# EAGLE design Adafruit Feather M0 Adalogger (EAGLE 7.5.0)
COMPANY: ADAFRUIT INDUSTRIES; DRAWN: KTOWN; REV: B
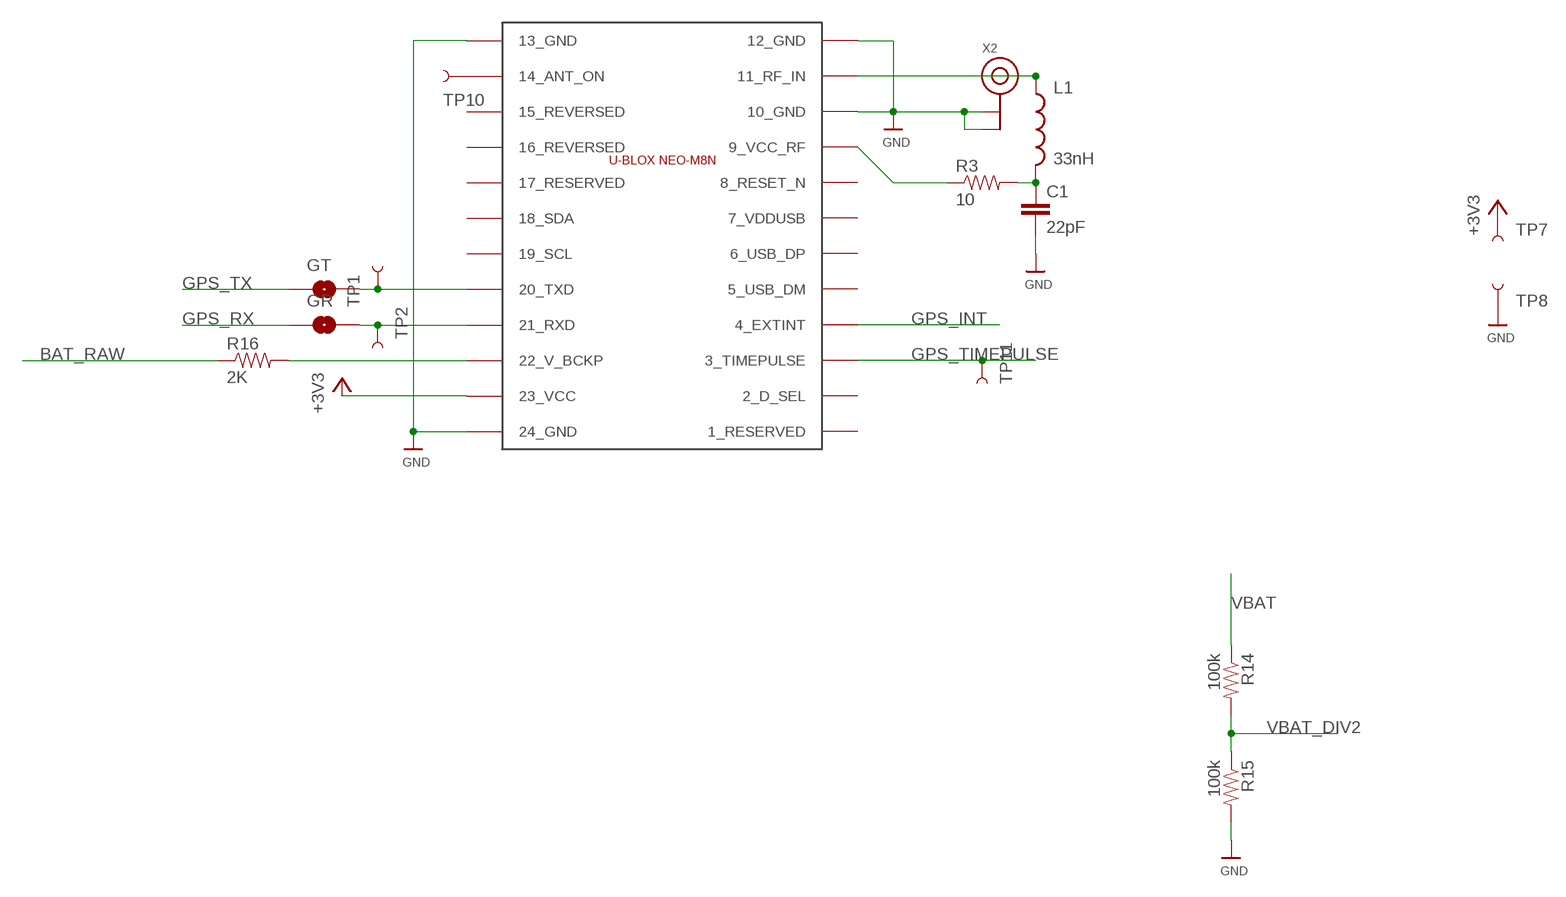
[diagram p0: schematic, sheet 1, part 1 of 2]
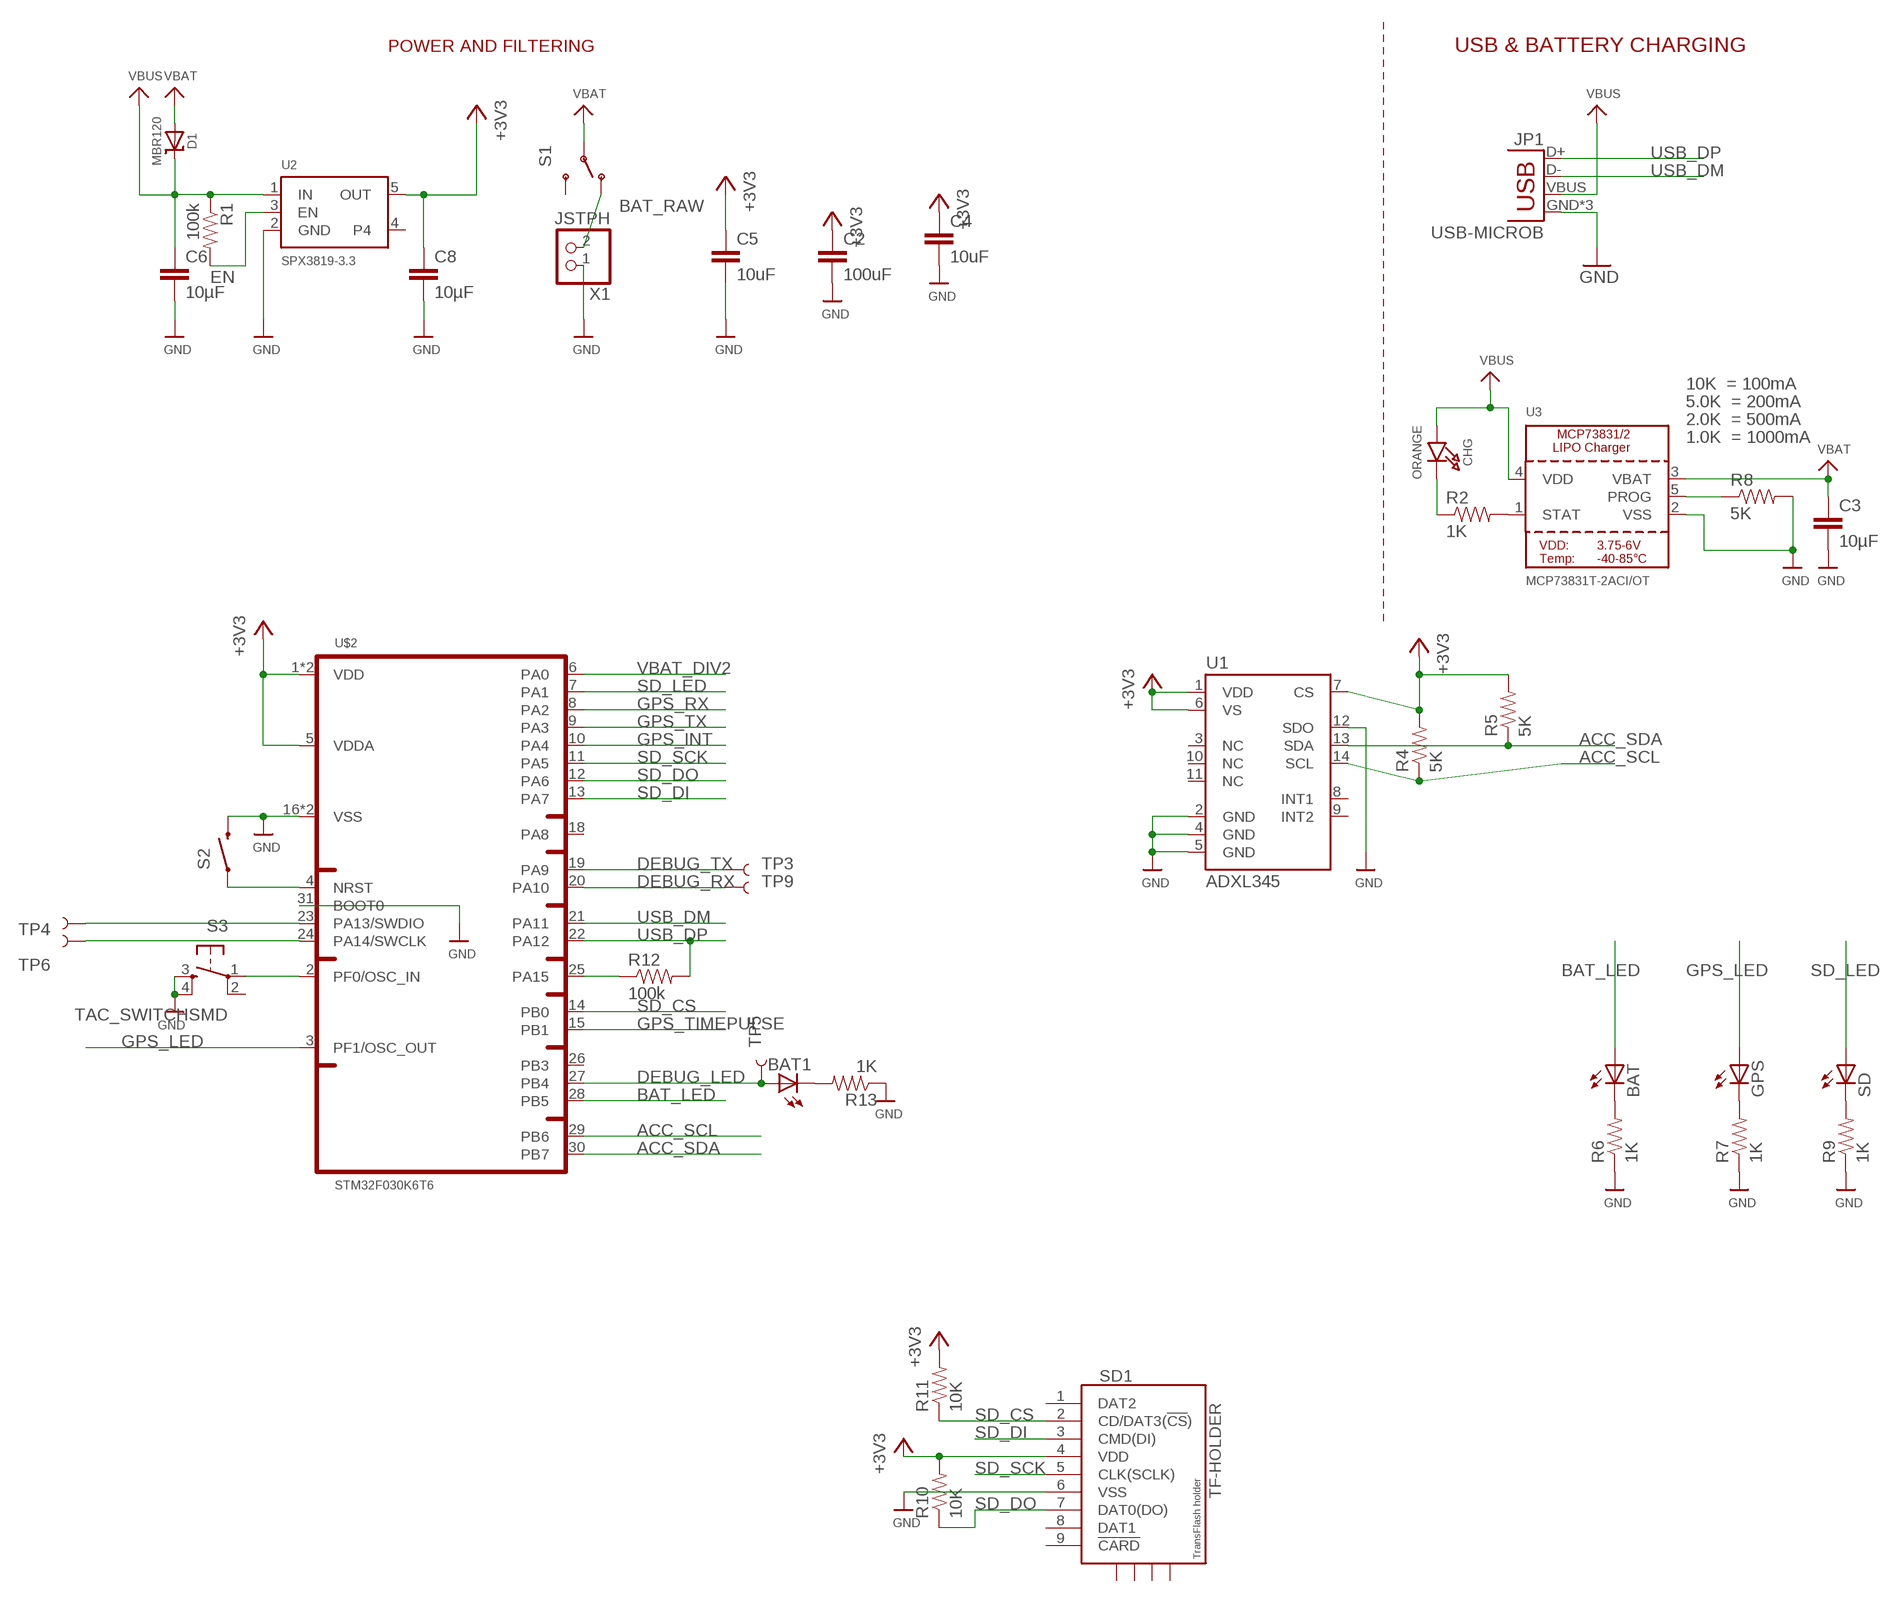
[diagram p1: schematic, sheet 1, part 2 of 2]

## Parts
BAT  LEDCHIPLED_0805  [CHIPLED_0805]
BAT1  LEDCHIPLED_0805  [CHIPLED_0805]
C1  22pF  CAP0805  [0805]
C2  100uF  100UF6.3V20%(1210)  [1210]
C3  10µF  CAP0805  [0805]
C4  10uF  CAP0805  [0805]
C5  10uF  CAP0805  [0805]
C6  10µF  CAP0805  [0805]
C8  10µF  CAP0805  [0805]
CHG  ORANGE  LED0805_NOOUTLINE  [CHIPLED_0805_NOOUTLINE]
D1  MBR120  DIODE-SCHOTTKYSOD-123  [SOD-123]
DEKU1  UBLOX_NEO-M8N  [UBLOX_NEO-M8N]
GPS  LEDCHIPLED_0805  [CHIPLED_0805]
GR  JUMPER-PAD-2-NO  [PAD-JUMPER-2-NO_NO_SILK]
GT  JUMPER-PAD-2-NO  [PAD-JUMPER-2-NO_NO_SILK]
JP1  USB-MICROB  [USB-MICROB]
L1  33nH  INDUCTOR0805  [0805]
R1  100k  RESISTOR0805-RES  [0805]
R2  1K  RESISTOR0805-RES  [0805]
R3  10  RESISTOR0805-RES  [0805]
R4  5K  RESISTOR0805-RES  [0805]
R5  5K  RESISTOR0805-RES  [0805]
R6  1K  RESISTOR0805-RES  [0805]
R7  1K  RESISTOR0805-RES  [0805]
R8  5K  RESISTOR0805-RES  [0805]
R9  1K  RESISTOR0805-RES  [0805]
R10  10K  RESISTOR0805-RES  [0805]
R11  10K  RESISTOR0805-RES  [0805]
R12  100k  RESISTOR0805-RES  [0805]
R13  1K  RESISTOR0805-RES  [0805]
R14  100k  RESISTOR0805-RES  [0805]
R15  100k  RESISTOR0805-RES  [0805]
R16  2K  RESISTOR0805-RES  [0805]
S1  SWITCH-SPDT-SMD-A  [SWITCH-SPST-SMD-A]
S2  SWITCH-MOMENTARY-2TURTLE  [KMR2]
S3  TAC_SWITCHSMD  [TACTILE-SWITCH-SMD]
SD  LEDCHIPLED_0805  [CHIPLED_0805]
SD1  TF-HOLDER  [TF-PULL]
TP1  TEST-POINT3X5  [PAD.03X.05]
TP2  TEST-POINT3X5  [PAD.03X.05]
TP3  TEST-POINT3X5  [PAD.03X.05]
TP4  TEST-POINT3X5  [PAD.03X.05]
TP5  TEST-POINT3X5  [PAD.03X.05]
TP6  TEST-POINT3X5  [PAD.03X.05]
TP7  TEST-POINT3X5  [PAD.03X.05]
TP8  TEST-POINT3X5  [PAD.03X.05]
TP9  TEST-POINT3X5  [PAD.03X.05]
TP10  TEST-POINT3X5  [PAD.03X.05]
TP11  TEST-POINT3X5  [PAD.03X.05]
U1  ADXL345  [LGA14]
U2  SPX3819-3.3  VREG_SOT23-5  [SOT23-5]
U3  MCP73831T-2ACI/OT  MCP73831/2  [SOT23-5]
U$2  STM32F030K6T6  [TQFP32-08]
X1  JSTPH  CON_JST_PH_2PIN  [JSTPH2]
X2  ANTENNA_U.FL  [U.FL]

## Nets
+3V3: C2.1 C4.1 C5.1 C8.1 DEKU1.23_VCC R4.2 R5.2 R10.2 R11.2 SD1.4(VDD) TP7.P$1 U1.1(VDD) U1.6(VS) U1.7(CS) U2.5(OUT) U$2.1(VDD) U$2.5(VDDA) U$2.17(VDD)
ACC_SCL: R4.1 U1.14(SCL) U$2.29(PB6)
ACC_SDA: R5.1 U1.13(SDA) U$2.30(PB7)
BAT_LED: BAT.A U$2.28(PB5)
BAT_RAW: R16.1 S1.1(O) X1.2
DEBUG_LED: BAT1.A TP5.P$1 U$2.27(PB4)
DEBUG_RX: TP9.P$1 U$2.20(PA10)
DEBUG_TX: TP3.P$1 U$2.19(PA9)
EN: R1.2 U2.3(EN)
GND: C1.2 C2.2 C3.2 C4.2 C5.2 C6.2 C8.2 DEKU1.10_GND DEKU1.12_GND DEKU1.13_GND DEKU1.24_GND JP1.GND JP1.MT1(GND) JP1.MT2(GND) R6.1 R7.1 R8.2 R9.1 R13.1 R15.2 S2.3 S3.3 S3.4 SD1.6(VSS) TP8.P$1 U1.2(GND) U1.4(GND) U1.5(GND) U1.12(SDO) U2.2(GND) U3.2(VSS) U$2.16(VSS) U$2.31(BOOT0) U$2.32(VSS) X1.1 X2.1(GND) X2.2(GND)
GPS_INT: DEKU1.4_EXTINT U$2.10(PA4)
GPS_LED: GPS.A U$2.3(PF1/OSC_OUT)
GPS_RX: GR.1 U$2.8(PA2)
GPS_TIMEPULSE: DEKU1.3_TIMEPULSE TP11.P$1 U$2.15(PB1)
GPS_TX: GT.1 U$2.9(PA3)
N$1: CHG.C R2.1
N$2: DEKU1.20_TXD GT.2 TP1.P$1
N$3: R2.2 U3.1(STAT)
N$4: R8.1 U3.5(PROG)
N$5: DEKU1.21_RXD GR.2 TP2.P$1
N$6: R12.1 U$2.25(PA15)
N$7: S2.1 U$2.4(NRST)
N$8: DEKU1.11_RF_IN L1.1 X2.3(SIGNAL)
N$9: DEKU1.9_VCC_RF R3.1
N$10: C1.1 L1.2 R3.2
N$12: BAT.C R6.2
N$13: GPS.C R7.2
N$14: R9.2 SD.C
N$15: S3.1 U$2.2(PF0/OSC_IN)
N$16: BAT1.C R13.2
N$17: DEKU1.22_V_BCKP R16.2
N$18: DEKU1.14_ANT_ON TP10.P$1
SD_CS: R11.1 SD1.2(CD/DAT3(!CS!)) U$2.14(PB0)
SD_DI: SD1.3(CMD(DI)) U$2.13(PA7)
SD_DO: R10.1 SD1.7(DAT0(DO)) U$2.12(PA6)
SD_LED: SD.A U$2.7(PA1)
SD_SCK: SD1.5(CLK(SCLK)) U$2.11(PA5)
SWCLK: TP6.P$1 U$2.24(PA14/SWCLK)
SWDIO: TP4.P$1 U$2.23(PA13/SWDIO)
USB_DM: JP1.D- U$2.21(PA11)
USB_DP: JP1.D+ R12.2 U$2.22(PA12)
VBAT: C3.1 D1.A R14.1 S1.2(P) U3.3(VBAT)
VBAT_DIV2: R14.2 R15.1 U$2.6(PA0)
VBUS: C6.1 CHG.A D1.C JP1.VBUS R1.1 U2.1(IN) U3.4(VDD)
Unconnected: DEKU1.1_RESERVED DEKU1.2_D_SEL DEKU1.5_USB_DM DEKU1.6_USB_DP DEKU1.7_VDDUSB DEKU1.8_RESET_N DEKU1.15_REVERSED DEKU1.16_REVERSED DEKU1.17_RESERVED DEKU1.18_SDA DEKU1.19_SCL S1.3(S) S3.2 SD1.1(DAT2) SD1.8(DAT1) SD1.9(!CARD) SD1.S1 SD1.S2 SD1.S3 SD1.S4 U1.3(NC) U1.8(INT1) U1.9(INT2) U1.10(NC) U1.11(NC) U2.4 U$2.18(PA8) U$2.26(PB3)

## Notes on the sheet
- POWER AND FILTERING | USB & BATTERY CHARGING
- 10K  = 100mA
- 5.0K  = 200mA
- 2.0K  = 500mA
- 1.0K  = 1000mA

## Library data of the parts
BAT BAT1 GPS SD = adafruit:LED: LED
C1 C3-C6 C8 = SparkFun-Passives:CAP: Capacitor Standard 0603 ceramic capacitor, and 0.1" leaded capacitor.
C2 = SparkFun-Capacitors:100UF6.3V20%(1210): CAP-09827; PROD_ID: CAP-09827
CHG = microbuilder:LED: LED
D1 = microbuilder:DIODE-SCHOTTKY
DEKU1 = gps_logger:UBLOX_NEO-M8N: UBLOX NEO-M8N GPS MODULE
GR GT = SparkFun-Passives:JUMPER-PAD-2-NO
JP1 = gps_logger:USB: USB Connectors USB-B-PTH is fully proven SKU : PRT-00139/CONN-08278 USB-miniB is fully proven SKU : PRT-00587 USB-A-PCB is untested. USB-A-H is throughly reviewed, but untested. Spark Fun Electronics SKU : PRT-00437 USB-B-SMT is throughly reviewed, but untested. Needs silkscreen touching up. USB-A-S has not been used/tested USB-MB-H has not been used/tested USB-MICROB has been used. CONN-09505; PROD_ID: CONN-09505
L1 = SparkFun-Passives:INDUCTOR: Inductors Basic Inductor/Choke - 0603 and 1206. Footprints are not proven and vary greatly between part numbers. INDUCTOR POWER 3.3UH 4.0A SMD 0.197" L x 0.197" W x 0.177" H (5.00mm x 5.00mm x 4.50mm)
R1-R16 = SparkFun-Passives:RESISTOR: Resistor Basic schematic elements and footprints for 0603, 1206, and PTH resistors.
S1 = gps_logger:SWITCH-SPDT: SPDT Switch Simple slide switch, Spark Fun Electronics SKU : COM-00102 DPDT SMT slide switch, AYZ0202, SWCH-08179
S2 = turtle:SWITCH-MOMENTARY-2: Various NO switches- pushbuttons, reed, etc
S3 = SparkFun-Retired:TAC_SWITCH: Momentary Switch Button commonly used for reset or general input. Spark Fun Electronics SKU : COM-00097 SMT- SWCH-08247; PROD_ID: SWCH-08247
SD1 = gps_logger:TF-HOLDER: TF / Micro SD socket is PUSH-PUSH type, the card can be pushed into and auto locked and pushed out by simply press the card. Surface Mounting type.
TP1-TP11 = SparkFun-Passives:TEST-POINT: Bare copper test points for troubleshooting or ICT
U1 = SparkFun-Sensors:ADXL345: 3-axis SPI/I2C 2/4/8/16g accelerometer
U2 = microbuilder:VREG_SOT23-5: SOT23-5 Fixed Voltage Regulators Part Current Out V Out V In V Dropout θJA (°C/W) TJ (°C) Digikey Part No. ADP121 150mA 3.3V 3.4-5.5V 0.09V @ 150mA -- -- ADP121-AUJZ33R7CT-ND ADP121 150mA 3.0V 3.1-5.5V 0.09V @ 150mA -- -- ADP121-AUJZ30R7CT-ND ADP122 300mA 3.3V 3.4-5.5V 0.085V @ 300mA -- -- ADP122AUJZ-3.3-R7CT-ND ADP1712 300mA 3.3V 3.5-5.5V 0.17V @ 300mA -- -- ADP1712AUJZ-3.3-R7TR-ND AP7311 (Low Cost) 150mA 3.3V 3.5-6V 0.15V @ 150mA -- -- AP7311-33WG-7DICT-ND LD39015M18R 150mA 1.8V 1.9V-5.5V 0.08V @ 100mA -- -- 497-6977-1-ND LP2985A-33DBVR 150mA 3.3V 3.3-16V 0.28V @ 150mA 206 150 296-18479-1-ND MCP1824T-3302E/OT 300mA 3.3V 3.5V-6V 0.2V @ 300mA -- -- MCP1824T-3302E/OTCT-ND MIC5205-2.5YM5 TR 150mA 2.5V 2.7-16V 0.165V @ 150mA -- -- 576-1257-2-ND MIC5205-3.0YM5 TR 150mA 3.0V 3.2V-16V 0.165V @ 150mA -- -- 576-1258-2-ND MIC5205-3.3YM5 TR 150mA 3.3V 3.5V-16V 0.165V @ 150mA -- -- 576-1259-2-ND TPS780330220 150mA 3.3V+2.2V 3.6-5.5V 250mV Max -- -- 296-23332-1-ND TDA3663/N1,135 100mA 3.3V 3.5-45V 0.18V @ 50mA -- -- 568-5343-1-ND Max operating temp can be calculated using θJA, TJ (max junction temperature), and power in watts. Set the "Maximum Ambient Temperature" until it reaches TJ ("Max Junction Temperature"), which is the absolute limit for safe use of the regulator: Heat Sink Temperature Calculator <http://www.daycounter.com/Calculators/Heat-Sink-Temperature-Calculator.phtml> For example, With 12V source into a 3.3V LP2985 and a 30mA load, we are dissipating (12V-3.3V) * 0.03A = 0.261W. With a θJA of 206 °C/W, a TJ of 150°C, and 261mW we can safely use the chip without a heat sink up to 75°C (=147.1°C Junction Temperature).
U3 = microbuilder:MCP73831/2: MCP73831/2 LIPO Charger VDD: 3.75 - 6V Temp -40 - 85°C Programmable Charge Rate: 15-500mA NOTE: STAT is a tri-state logic output on the MCP73831 and an open-drain output on the MCP73832. SOT23-5 with 4.2V output and tri-state logic on STAT = MCP73831T-2ACI/OT
U$2 = STM32F030K6T6:STM32F030K6T6
X1 = microbuilder:CON_JST_PH_2PIN: JST 2-Pin Right-Angle Connector PH-Series - 4UConnector: 17311 SH-Series - 4UConnector: 07278
X2 = adafruit:ANTENNA_U.FL: U.FL Antenna Connector

## Board
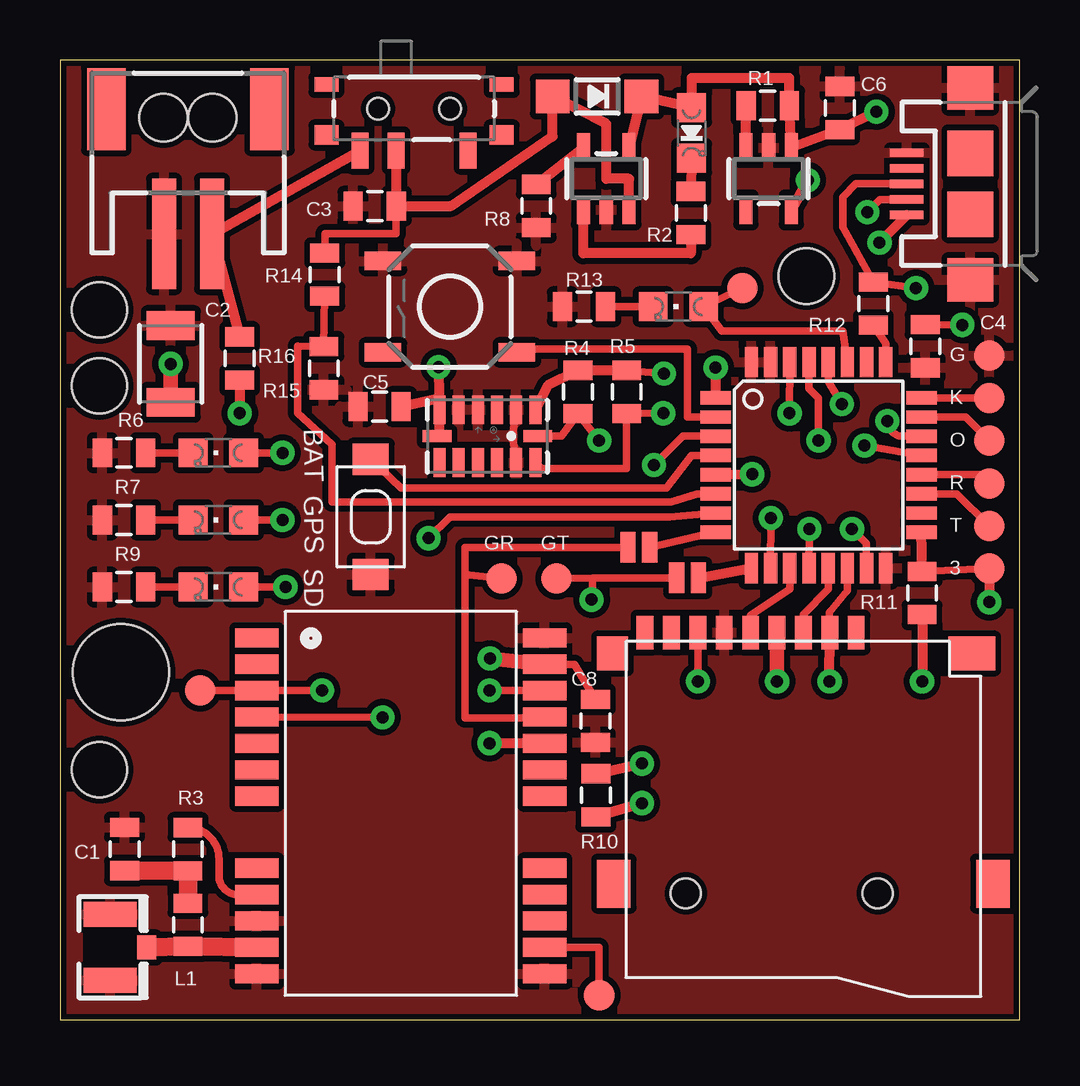
[diagram p2: board, top side]
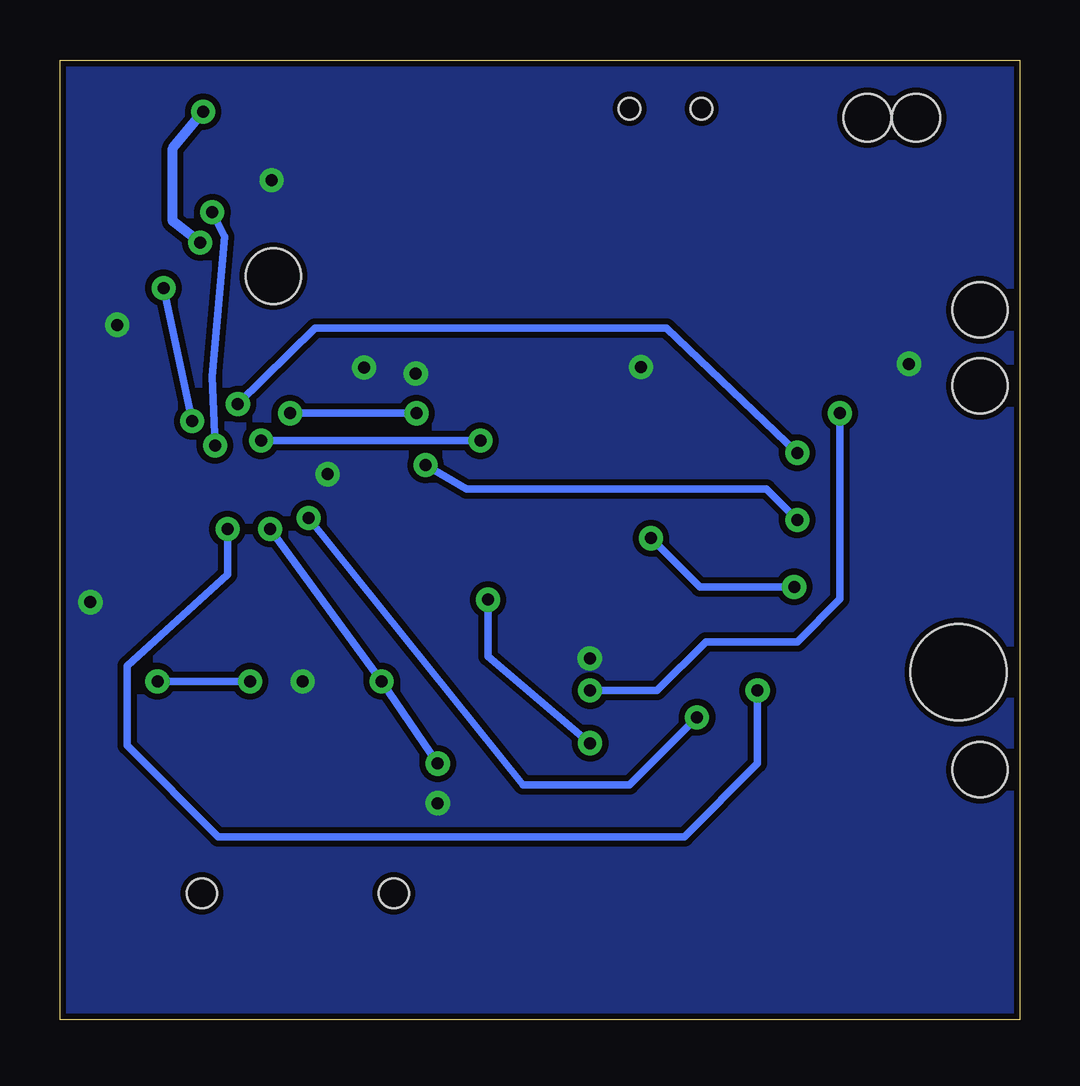
[diagram p3: board, bottom side, seen from below]

Size 40 x 40 mm. Coordinates in mm from the lower left corner, seen from the top.
Outline: 0,0 40,0 40,40 0,40 0,0
Copper layers (1*16): Top 0.035mm / dielectric 1.5mm / Bottom 0.035mm
Design rules "SparkFun-2-layer-STANDARD": minimum track width 10mil, minimum drill 20mil, track to track 10mil, track to pad 8mil, pad to pad 8mil, via to via 10mil, smd to smd 8mil, copper to edge 8mil, drill to drill 8mil, minimum pad ring 10mil, minimum via ring 10mil, stop-mask expansion 4mil, vias tented up to drill 25mil, thermal gap 10mil
Holes 2 mm at 4.32,37.59 6.35,37.59
Holes 2.3 mm at 1.65,10.41 1.65,29.59 1.65,26.42 31.11,30.99
Holes 4 mm at 2.54,14.48

### Footprints (pad centres in the part's own frame; a part is rotated, then mirrored left to right if it is on the bottom)
CHIPLED_0805 = smd 1.2 x 1.2: A 0,-1.05; C 0,1.05
0805 = smd 0.8 x 1.2: 1 -0.9,0; 2 0.9,0
1210 = smd 1.2 x 2: 1 -1.6,0; 2 1.6,0
CHIPLED_0805_NOOUTLINE = smd 1.2 x 1.2: A 0,-1.05; C 0,1.05
SOD-123 = smd 1.4 x 1.4: A 1.85,0; C -1.85,0
UBLOX_NEO-M8N = smd 1.8 x 0.8: 1_RESERVED 6.4,-7.4; 2_D_SEL 6.4,-6.3; 3_TIMEPULSE 6.4,-5.2; 4_EXTINT 6.4,-4.1; 5_USB_DM 6.4,-3; 6_USB_DP 6.4,-1.9; 7_VDDUSB 6.4,-0.8; 8_RESET_N 6.4,2.2; 9_VCC_RF 6.4,3.3; 10_GND 6.4,4.4; 11_RF_IN 6.4,5.5; 12_GND 6.4,6.6; 13_GND -5.6,6.6; 14_ANT_ON -5.6,5.5; 15_REVERSED -5.6,4.4; 16_REVERSED -5.6,3.3; 17_RESERVED -5.6,2.2; 18_SDA -5.6,-0.8; 19_SCL -5.6,-1.9; 20_TXD -5.6,-3; 21_RXD -5.6,-4.1; 22_V_BCKP -5.6,-5.2; 23_VCC -5.6,-6.3; 24_GND -5.6,-7.4
PAD-JUMPER-2-NO_NO_SILK = smd 0.635 x 1.27: 1 -0.45,0; 2 0.45,0
USB-MICROB = smd 0.35 x 1.4: D+ 0,2.65; D- -0.65,2.65; GND 1.3,2.65; ID 0.65,2.65; VBUS -1.3,2.65 | smd 1.8 x 1.9: MT1 -4,0; MT2 4,0 | smd 1.9 x 1.9: P$1 -1.27,0; P$2 1.27,0
SWITCH-SPST-SMD-A = smd 0.7 x 1.5: 1 -2.25,-1.75; 2 -0.75,-1.75; 3 2.25,-1.75 | smd 1 x 0.6: GND1 -3.65,1; GND3 3.65,1 | smd 1 x 0.8: GND2 -3.65,-1.1; GND4 3.65,-1.1 | hole 0.9: -1.5,0; 1.5,0
KMR2 = smd 1.3 x 1.5: 1 2.4,0; 3 -2.4,0
TACTILE-SWITCH-SMD = smd 1.524 x 0.762: 1 -2.794,1.905; 2 2.794,1.905; 3 -2.794,-1.905; 4 2.794,-1.905
TF-PULL = smd 0.7 x 1.4: 1 -2.2,-7.62; 2 -1.1,-7.62; 3 0,-7.62; 4 1.1,-7.62; 5 2.2,-7.62; 6 3.3,-7.62; 7 4.4,-7.62; 8 5.5,-7.62; 9 6.6,-7.62 | smd 1.4 x 2: S1 -7.9,2.85; S2 7.9,2.85 | smd 1.28 x 1.4: S3 7.96,-6.75 | smd 1.95 x 1.4: S4 -7.025,-6.75 | hole 1.25: -3.1,3.25; 4.9,3.25
PAD.03X.05 = smd 1.27 x 1.27: P$1 0,0
LGA14 = smd 0.5 x 1.2: 1 2,1.1; 2 1.2,1.1; 3 0.4,1.1; 4 -0.4,1.1; 5 -1.2,1.1; 6 -2,1.1; 8 -2,-1.1; 9 -1.2,-1.1; 10 -0.4,-1.1; 11 0.4,-1.1; 12 1.2,-1.1; 13 2,-1.1 | smd 1.2 x 0.5: 7 -2.1,0; 14 2.1,0
SOT23-5 = smd 0.55 x 1.2: 1 -0.95,-1.3; 2 0,-1.3; 3 0.95,-1.3; 4 0.95,1.3; 5 -0.95,1.3
TQFP32-08 = smd 1.27 x 0.559: 1 -4.293,2.8; 2 -4.293,2; 3 -4.293,1.2; 4 -4.293,0.4; 5 -4.293,-0.4; 6 -4.293,-1.2; 7 -4.293,-2; 8 -4.293,-2.8; 17 4.293,-2.8; 18 4.293,-2; 19 4.293,-1.2; 20 4.293,-0.4; 21 4.293,0.4; 22 4.293,1.2; 23 4.293,2; 24 4.293,2.8 | smd 0.559 x 1.27: 9 -2.8,-4.293; 10 -2,-4.293; 11 -1.2,-4.293; 12 -0.4,-4.293; 13 0.4,-4.293; 14 1.2,-4.293; 15 2,-4.293; 16 2.8,-4.293; 25 2.8,4.293; 26 2,4.293; 27 1.2,4.293; 28 0.4,4.293; 29 -0.4,4.293; 30 -1.2,4.293; 31 -2,4.293; 32 -2.8,4.293
JSTPH2 = smd 1 x 4.6: 1 -1,-3.7; 2 1,-3.7 | smd 1.6 x 3.4: NC1 -3.4,1.5; NC2 3.4,1.5
U.FL = smd 2.2 x 1.05: 1 0,1.375; 2 0,-1.375 | smd 0.8 x 1: 3 1.525,0

### Placement (x,y rotation side)
BAT  6.6,23.62 90 top
BAT1  25.78,29.72 90 top
C1  2.69,7.11 90 top
C2  4.62,27.33 90 top
C3  13.12,33.91 180 top
C4  36.07,28.07 270 top
C5  13.32,25.55 180 top
C6  32.51,38 90 top
C8  22.33,12.45 270 top
CHG  26.33,36.96 180 top
D1  22.39,38.48 180 top
DEKU1  14.61,8.51 180 top
GPS  6.6,20.83 90 top
GR  24.13,19.68 180 top
GT  26.16,18.41 180 top
JP1  37.95,34.84 90 top
L1  5.33,3.95 90 top
R1  29.5,38.1 180 top
R2  26.3,33.62 270 top
R3  5.33,7.1 270 top
R4  21.59,26.16 90 top
R5  23.62,26.16 90 top
R6  2.67,23.62 0 top
R7  2.67,20.83 0 top
R8  19.85,33.91 270 top
R9  2.67,18.03 0 top
R10  22.34,9.35 270 top
R11  35.94,17.78 90 top
R12  33.91,29.84 90 top
R13  21.84,29.72 0 top
R14  11.04,31.05 270 top
R15  11,27.15 270 top
R16  7.49,27.56 270 top
S1  14.76,37.97 0 top
S2  12.95,20.95 90 top
S3  16.26,29.72 180 top
SD  6.6,18.03 90 top
SD1  30.99,8.51 180 top
TP1  20.7,18.39 0 top
TP2  18.41,18.39 0 top
TP3  38.73,20.57 0 top
TP4  38.73,24.13 0 top
TP5  28.45,30.48 0 top
TP6  38.73,25.91 0 top
TP7  38.73,18.8 0 top
TP8  38.73,27.69 0 top
TP9  38.73,22.35 0 top
TP10  22.48,1.02 0 top
TP11  5.84,13.72 0 top
U1  17.82,24.32 0 top
U2  29.54,35.05 180 top
U3  22.77,35.05 0 top
U$2  31.62,23.11 0 top
X1  5.33,36.45 0 top
X2  2.1,3.01 0 top

### Tracks (layer width: path | path; a pad name or v marks a point on that pad's centre or on a via)
+3V3  (via drill 0.5)
  Top 0.305: C8.1 21.44,14.8 DEKU1.23_VCC | TP7.P$1 R11.2 | R5.2 v25.17,26.92 | C4.1 v37.62,28.96
  Top 0.406: v27.33,27.18 U$2.1 | U$2.5 v28.85,22.73 | R5.2 R4.2 20.33,26.43 U1.1 | U1.7 15.82,24.42 U1.6 15.81,25.91 | v15.79,27.2 15.81,25.91 | v24.26,9.02 R10.2 | R11.2 U$2.17 | C5.1 15.81,25.91 | TP7.P$1 v38.73,17.4 | v31.18,34.99 U2.5
  Top 0.61: v29.9,14.1 SD1.4 | v17.92,15.05 DEKU1.23_VCC | v4.61,27.33 C2.1
  pour Bottom (isolate 0.254): 0,40.01 0,0 40.01,0 40.01,40.01
ACC_SCL  (via drill 0.5)
  Top 0.305: U1.14 20.9,24.32 R4.1 v22.48,24.13 | v31.62,24.13 31.62,25.91 31.22,26.31 U$2.29
  Bottom 0.305: v22.48,24.13 v31.62,24.13
ACC_SDA  (via drill 0.5)
  Top 0.305: v25.15,25.27 R5.1 23.61,22.97 20.07,22.97 U1.13 | v30.42,25.27 U$2.30
  Bottom 0.305: v25.15,25.27 v30.42,25.27
BAT_LED  (via drill 0.5)
  Top 0.305: v9.27,23.62 BAT.A | v32.59,25.65 32.02,26.6 U$2.28
  Top 0.406: 32.02,27.69 U$2.28
  Bottom 0.305: v9.27,23.62 14.73,28.83 29.36,28.83 v32.59,25.65
BAT_RAW
  Top 0.406: S1.1 X1.2 R16.1
DEBUG_LED
  Top 0.305: U$2.27 32.64,28.7 27.59,28.7 BAT1.A TP5.P$1
DEBUG_RX
  Top 0.305: U$2.20 38.37,22.71 TP9.P$1
DEBUG_TX
  Top 0.305: U$2.19 37.4,21.91 TP3.P$1
EN
  Top 0.406: U2.3 R1.2
GND
  Top 0.305: U1.12 18.87,24.33 U1.2
  pour Top (isolate 0.254): 0,40.01 0,0 40.01,0 40.01,40.01
GPS_INT  (via drill 0.5)
  Top 0.305: DEKU1.4_EXTINT v13.45,12.6 | v29.64,20.9 U$2.10
  Bottom 0.305: v13.45,12.6 16.26,9.78 20.7,9.78 v29.64,20.9
GPS_LED  (via drill 0.5)
  Top 0.305: GPS.A v9.27,20.83 | v24.77,23.11 25.96,24.31 U$2.3
  Bottom 0.305: v9.27,20.83 10.56,22.12 23.05,22.12 v24.77,23.11
GPS_RX
  Top 0.305: GR.1 U$2.8
GPS_TIMEPULSE  (via drill 0.5)
  Top 0.305: v33.02,20.45 33.62,19.84 U$2.15 | v10.92,13.72 DEKU1.3_TIMEPULSE TP11.P$1
  Bottom 0.305: v33.02,20.45 33.02,18.54 37.21,14.73 37.21,11.43 33.4,7.62 13.97,7.62 10.92,10.67 v10.92,13.72
GPS_TX
  Top 0.406: GT.1 U$2.9
N$1
  Top 0.406: CHG.C R2.1
N$2  (via drill 0.5)
  Top 0.305: 22.22,18.4 GT.2 | v22.16,17.5 22.22,18.4 | TP1.P$1 22.22,18.4
  Top 0.406: DEKU1.20_TXD v17.91,11.52
  Bottom 0.305: v17.91,11.52 22.16,15.14 v22.16,17.5
N$3
  Top 0.406: R2.2 26.3,31.94 21.82,31.94 U3.1
N$4
  Top 0.406: R8.1 U3.5
N$5
  Top 0.305: GR.2 16.89,19.68 16.89,18.54 | 16.89,18.54 16.89,12.57 20.2,12.57 | TP2.P$1 16.89,18.54
  Top 0.406: 20.2,12.57 DEKU1.21_RXD
N$6
  Top 0.305: R12.1 34.42,28.18 U$2.25
N$7
  Top 0.305: U$2.4 26.31,23.51 25.27,22.16 14.21,22.16 S2.1
N$8
  Top 0.762: X2.3 L1.1 DEKU1.11_RF_IN
N$9
  Top 0.305: DEKU1.9_VCC_RF 7.42,5.21 arc-90 6.63,5.99 6.63,6.7 arc90 R3.1
N$10
  Top 0.762: L1.2 R3.2 C1.1
N$12
  Top 0.305: R6.2 BAT.C
N$13
  Top 0.305: R7.2 GPS.C
N$14
  Top 0.305: R9.2 SD.C
N$15
  Top 0.305: S3.1 19.68,27.94 26.16,27.94 26.16,25.11 U$2.2
N$16
  Top 0.305: BAT1.C R13.2
N$17  (via drill 0.5)
  Top 0.305: v17.91,13.72 DEKU1.22_V_BCKP
  Top 0.406: R16.2 v7.49,25.27
  Bottom 0.305: v17.91,13.72 15.11,13.72 13.08,15.75 9.27,15.75 7.49,17.53 v7.49,25.27
N$18
  Top 0.305: DEKU1.14_ANT_ON 22.48,3.01 TP10.P$1
SD_CS  (via drill 0.5)
  Top 0.305: U$2.14 32.83,17.89 32.08,16.97 SD1.2
  Top 0.406: R11.1 v35.94,14.1 | v32.08,14.1 SD1.2
  Bottom 0.305: v35.94,14.1 v32.08,14.1
SD_DI
  Top 0.305: SD1.3 30.99,16.89 32.03,17.95 U$2.13
SD_DO  (via drill 0.5)
  Top 0.305: U$2.12 v31.24,20.45 | v26.59,14.1 SD1.7
  Top 0.406: R10.1 v24.26,10.67
  Bottom 0.305: v31.24,20.45 v26.59,14.1 v24.26,10.67
SD_LED  (via drill 0.5)
  Top 0.305: SD.A v9.4,18.03 | U$2.7 25.4,20.95 16.26,20.95 v15.37,20.07
  Bottom 0.305: v9.4,18.03 13.34,18.03 v15.37,20.07
SD_SCK
  Top 0.305: SD1.5 28.78,16.85 30.43,17.96 U$2.11
SWCLK
  Top 0.305: U$2.24 TP6.P$1
SWDIO
  Top 0.305: U$2.23 37.75,25.11 TP4.P$1
USB_DM  (via drill 0.5)
  Top 0.305: JP1.D- 34.19,34.19 v33.66,33.66 | v33.54,23.93 U$2.21
  Bottom 0.305: v33.66,33.66 33.15,32.64 33.66,26.8 v33.54,23.93
USB_DP  (via drill 0.5)
  Top 0.305: v35.69,30.49 R12.2 32.64,33.03 32.64,34.29 33.19,34.84 JP1.D+ | v34.49,24.94 arc90 35.17,24.31 U$2.22
  Bottom 0.305: v35.69,30.49 v34.49,24.94
VBAT
  Top 0.305: C3.1 14.02,32.77 11.05,32.77 R14.1
  Top 0.406: U3.3 23.72,35.05 22.77,35.05 22.77,37.34 D1.A 20.54,36.82 16.29,33.91 C3.1 S1.2
VBAT_DIV2
  Top 0.305: U$2.6 26.56,21.91 25.46,21.58 11.34,21.58 11.34,23.96 9.91,25.27 9.91,28.07 R15.1 R14.2
VBUS  (via drill 0.5)
  Top 0.406: U3.4 D1.C CHG.A 26.33,39.24 30.4,39.24 R1.1 U2.1 C6.1 v34.04,37.85 | JP1.VBUS v34.16,32.38
  Bottom 0.406: v34.16,32.38 35.31,33.27 35.31,36.32 v34.04,37.85

### Text on the board
tNames: G | K | BAT | O | GPS | R | T | SD | 3